# Altium project PCB_Tel_GPRS_BT-V1_Rev1.PrjPcb (part 1 of 2)
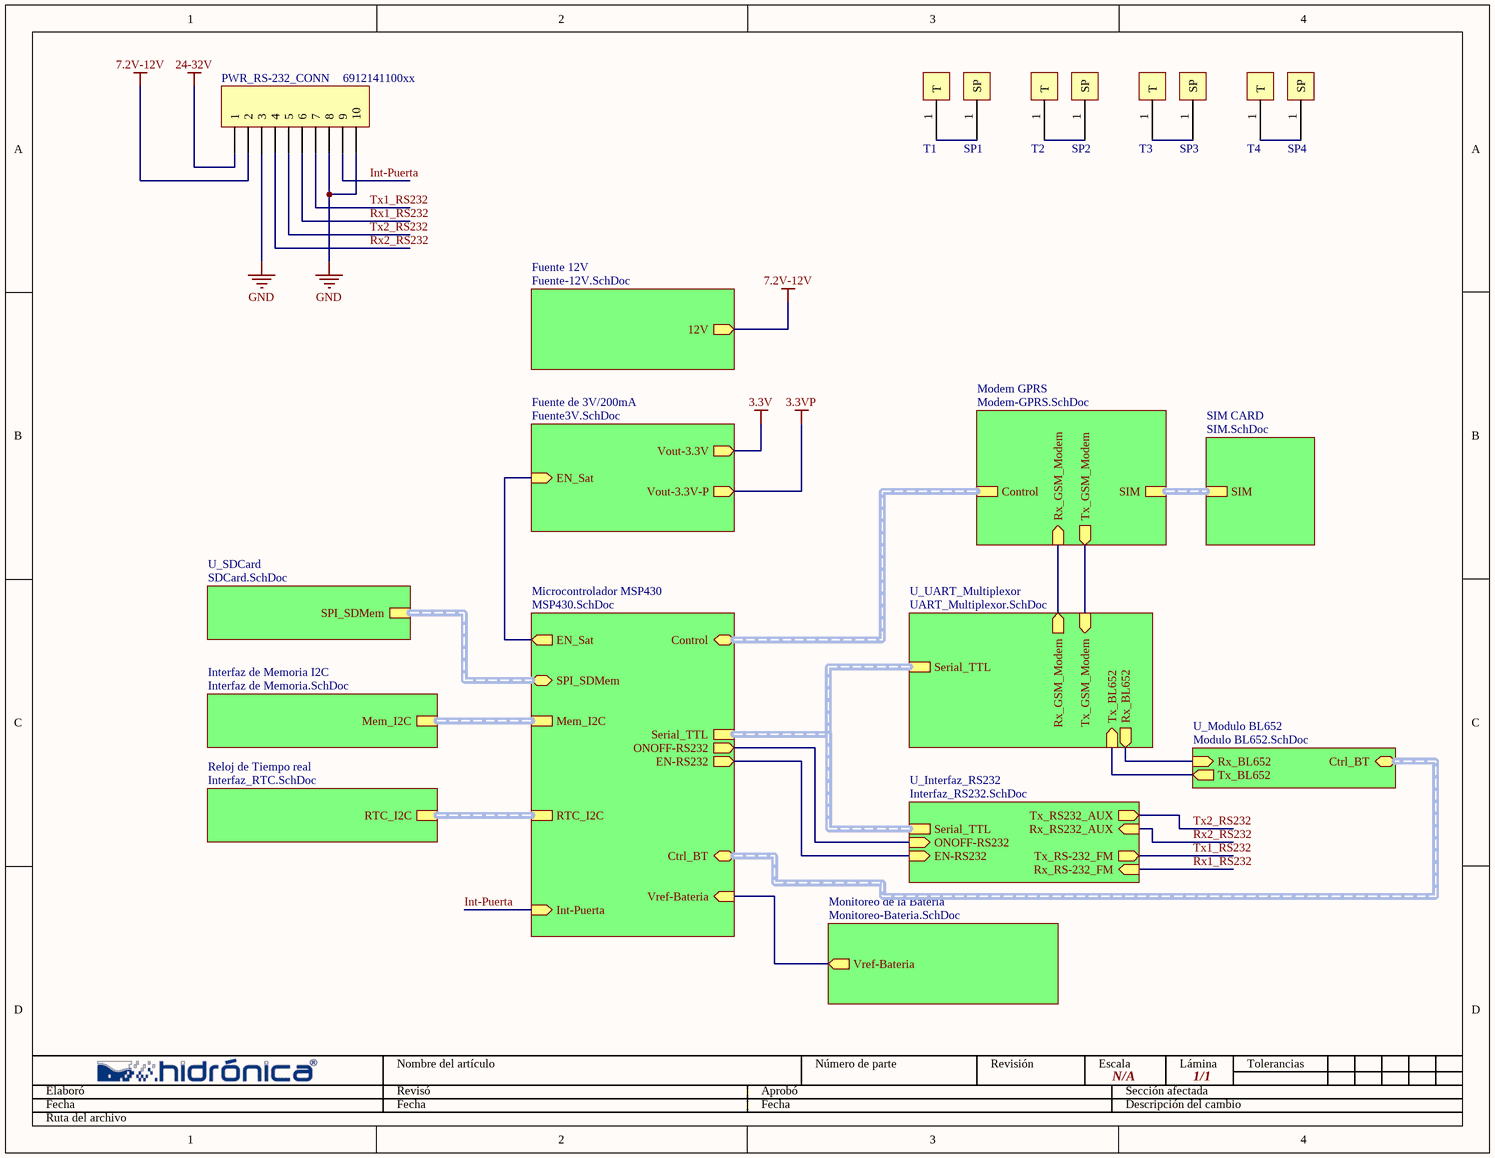
[diagram p0: Principal.SchDoc]
13 sheets, 132 parts. Net scope: hierarchical (ports join the sheet entries above them; power ports are global).
Board file: TEL-GPRS-BT-V1_0 Rev1.PcbDoc
Sheets:
  Principal.SchDoc
    Fuente de 3V/200mA = Fuente3V.SchDoc
    Interfaz de Memoria I2C = Interfaz de Memoria.SchDoc
    Reloj de Tiempo real = Interfaz_RTC.SchDoc
    Monitoreo de la Bateria = Monitoreo-Bateria.SchDoc
    Microcontrolador MSP430 = MSP430.SchDoc
    Fuente 12V = Fuente-12V.SchDoc
    Modem GPRS = Modem-GPRS.SchDoc
    SIM CARD = SIM.SchDoc
    U_Interfaz_RS232 = Interfaz_RS232.SchDoc
    U_UART_Multiplexor = UART_Multiplexor.SchDoc
    U_SDCard = SDCard.SchDoc
    U_Modulo BL652 = Modulo BL652.SchDoc

## Sheet Principal.SchDoc
size Letter; ApprovedBy: M. en C. Fernando Bolaños; CheckedBy: M. en C. José Alberto Balderas Castillo (CID); Author: M. en C. José Alberto Balderas Castillo (CID); Revision: v1; NombreTarjeta: TELCOMGPRS-v1; NumeroDeHoja: 1 de 7; NombreBloque: Diagrama a Bloques; FechaDiseno: 02-Junio-2015; FechaRevision: 05-Junio-2015; FechaAprobacion: 16-Junio-2015; TamanoHoja: Carta; NombreProyecto: Telemetria GPRS de Bajo Consumo de Energia

### Parts
PWR_RS-232_CONN  6912141100xx  [691214110002x2_691214110003x2]
SP1  (no value)  [SPACER]
SP2  (no value)  [SPACER]
SP3  (no value)  [SPACER]
SP4  (no value)  [SPACER]
T1  (no value)  [Tornillo]
T2  (no value)  [Tornillo]
T3  (no value)  [Tornillo]
T4  (no value)  [Tornillo]

### Sub-sheets
Fuente 12V = Fuente-12V.SchDoc: 12V (out)
Fuente de 3V/200mA = Fuente3V.SchDoc: Vout-3.3V (out), Vout-3.3V-P (out), EN_Sat (in)
Interfaz de Memoria I2C = Interfaz de Memoria.SchDoc: Mem_I2C (harness Memorias I2C)
Microcontrolador MSP430 = MSP430.SchDoc: Mem_I2C (harness Memorias I2C), RTC_I2C (harness Reloj RTC), Serial_TTL (harness Puertos Seriales), Vref-Bateria (in), Int-Puerta (in), ONOFF-RS232 (out), EN-RS232 (out), EN_Sat (out), Control (harness Control), SPI_SDMem (harness SPI1), Ctrl_BT (harness Bluetooth_Ctrl)
Modem GPRS = Modem-GPRS.SchDoc: SIM (harness SIM), Control (harness Control), Rx_GSM_Modem (in), Tx_GSM_Modem (out)
Monitoreo de la Bateria = Monitoreo-Bateria.SchDoc: Vref-Bateria (out)
Reloj de Tiempo real = Interfaz_RTC.SchDoc: RTC_I2C (harness Reloj RTC)
SIM CARD = SIM.SchDoc: SIM (harness SIM)
U_Interfaz_RS232 = Interfaz_RS232.SchDoc: Serial_TTL (harness Puertos Seriales), Rx_RS-232_FM (in), Tx_RS-232_FM (out), ONOFF-RS232 (in), EN-RS232 (in), Tx_RS232_AUX (out), Rx_RS232_AUX (in)
U_Modulo BL652 = Modulo BL652.SchDoc: Rx_BL652 (in), Tx_BL652 (out), Ctrl_BT (harness Bluetooth_Ctrl)
U_SDCard = SDCard.SchDoc: SPI_SDMem (harness SPI1)
U_UART_Multiplexor = UART_Multiplexor.SchDoc: Rx_GSM_Modem (out), Rx_BL652 (out), Tx_GSM_Modem (in), Tx_BL652 (in), Serial_TTL (harness Puertos Seriales)

### Nets
7.2V-12V: PWR_RS-232_CONN.2 ; sheet Fuente 12V/12V
24-32V: PWR_RS-232_CONN.1
GND: PWR_RS-232_CONN.3 PWR_RS-232_CONN.8 PWR_RS-232_CONN.10
BT_Rx: sheet U_UART_Multiplexor/Rx_BL652, sheet U_Modulo BL652/Rx_BL652
BT_Tx: sheet U_UART_Multiplexor/Tx_BL652, sheet U_Modulo BL652/Tx_BL652
Int-Puerta: PWR_RS-232_CONN.9 ; sheet Microcontrolador MSP430/Int-Puerta
Rx1_RS232: PWR_RS-232_CONN.6 ; sheet U_Interfaz_RS232/Rx_RS-232_FM
Rx2_RS232: PWR_RS-232_CONN.4 ; sheet U_Interfaz_RS232/Rx_RS232_AUX
Tx1_RS232: PWR_RS-232_CONN.7 ; sheet U_Interfaz_RS232/Tx_RS-232_FM
Tx2_RS232: PWR_RS-232_CONN.5 ; sheet U_Interfaz_RS232/Tx_RS232_AUX
NetSP1_1: SP1.1(SP) T1.1(T)
NetSP2_1: SP2.1(SP) T2.1(T)
NetSP3_1: SP3.1(SP) T3.1(T)
NetSP4_1: SP4.1(SP) T4.1(T)
NetU2_1: sheet Fuente de 3V/200mA/EN_Sat, sheet Microcontrolador MSP430/EN_Sat
NetU5D1_2: sheet Monitoreo de la Bateria/Vref-Bateria, sheet Microcontrolador MSP430/Vref-Bateria
NetU6_3: sheet Microcontrolador MSP430/EN-RS232, sheet U_Interfaz_RS232/EN-RS232
NetU6_4: sheet Microcontrolador MSP430/ONOFF-RS232, sheet U_Interfaz_RS232/ONOFF-RS232
NetU11_2: sheet Modem GPRS/Rx_GSM_Modem, sheet U_UART_Multiplexor/Rx_GSM_Modem
NetU11_4: sheet Modem GPRS/Tx_GSM_Modem, sheet U_UART_Multiplexor/Tx_GSM_Modem

### Buses and harness runs
harness sheet Interfaz de Memoria I2C/Mem_I2C = sheet Microcontrolador MSP430/Mem_I2C
harness sheet Microcontrolador MSP430/Control = sheet Modem GPRS/Control
harness sheet Microcontrolador MSP430/Ctrl_BT = sheet U_Modulo BL652/Ctrl_BT
harness sheet Microcontrolador MSP430/RTC_I2C = sheet Reloj de Tiempo real/RTC_I2C
harness sheet Microcontrolador MSP430/Serial_TTL = sheet U_Interfaz_RS232/Serial_TTL = sheet U_UART_Multiplexor/Serial_TTL
harness sheet Microcontrolador MSP430/SPI_SDMem = sheet U_SDCard/SPI_SDMem
harness sheet Modem GPRS/SIM = sheet SIM CARD/SIM

### Notes on the sheet
- Elaboró
- Fecha
- Nombre del artículo
- Revisó
- Aprobó
- Número de parte
- Revisión
- Escala
- N/A
- Sección afectada
- Descripción del cambio
- Lámina
- 1/1
- Tolerancias
- Ruta del archivo

### Library data of the parts
PWR_RS-232_CONN = Header 10H: 10 Position Wire to Board Terminal Block Horizontal with Board 0.200" (5.08mm) Through Hole; Manufacturer: Wurth Elektronik; Number of Levels: 1; Positions Per Level: 10; Pitch: 3.5 mm; Current: 15A; Voltage: 300V; Wire Gauge: 14-30 AWG; Wire Termination: Screw - Rising Cage Clamp; Torque - Screw: 0.5-0.6 Nm (4.4-5.3 Lb-In); Screw Thread: M3; LatestRevisionDate: 17-Jul-2002; LatestRevisionNote: Re-released for DXP Platform.; Publisher: Altium Limited; Numero de Parte: 6912141100xx; Supplier 1: Wurth Elektronik; Supplier Part Number 1: 6912141100xx; Manufacturer Part Number: 6912141100xx; RoHS: RoHS Compliant; Category: Connectors, Interconnects; Stock 1: 453; Pricing 1: 1=5.34, 10=5.189, 50=4.85, 100=4.462, 250=4.12248, 500=3.9285, 1000=3.686 (USD); Packaging: Bulk; Part Status: Active; Mating Orientation: Horizontal with Board; Mounting Type: Through Hole; Features: Interlocking (Side); Color: Green; Operating Temperature: -; Housing Material: Polyamide (PA), Nylon; Contact Material - Plating: -; Clamp Material - Plating: -; Screw Material - Plating: -; ComponentLink1URL: http://media.digikey.com/pdf/Data%20Sheets/Phoenix%20Contact%20PDFs/1715802.pdf; ComponentLink1Description: http://media.digikey.com/pdf/Data%20Sheets/Phoenix%20Contact%20PDFs/1715802.pdf
SP1-SP4 T1-T4 = PRUEBA: No Aplica; Numero de Parte: No Aplica

## Sheet Fuente3V.SchDoc
size Letter; ApprovedBy: M. en C. Fernando Bolaños; CheckedBy: M. en C. José Alberto Balderas Castillo (CID); Author: M. en C. José Alberto Balderas Castillo (CID); Revision: v1; NombreTarjeta: TELCOMGPRS-v1; NumeroDeHoja: 2 de 7; NombreBloque: Fuente de alimentacion de 3.3V de bajo consumo; FechaDiseno: 02-Junio-2015; FechaRevision: 05-Junio-2015; FechaAprobacion: 16-Junio-2015; TamanoHoja: Carta; NombreProyecto: Telemetria GPRS de Bajo Consumo de Energia
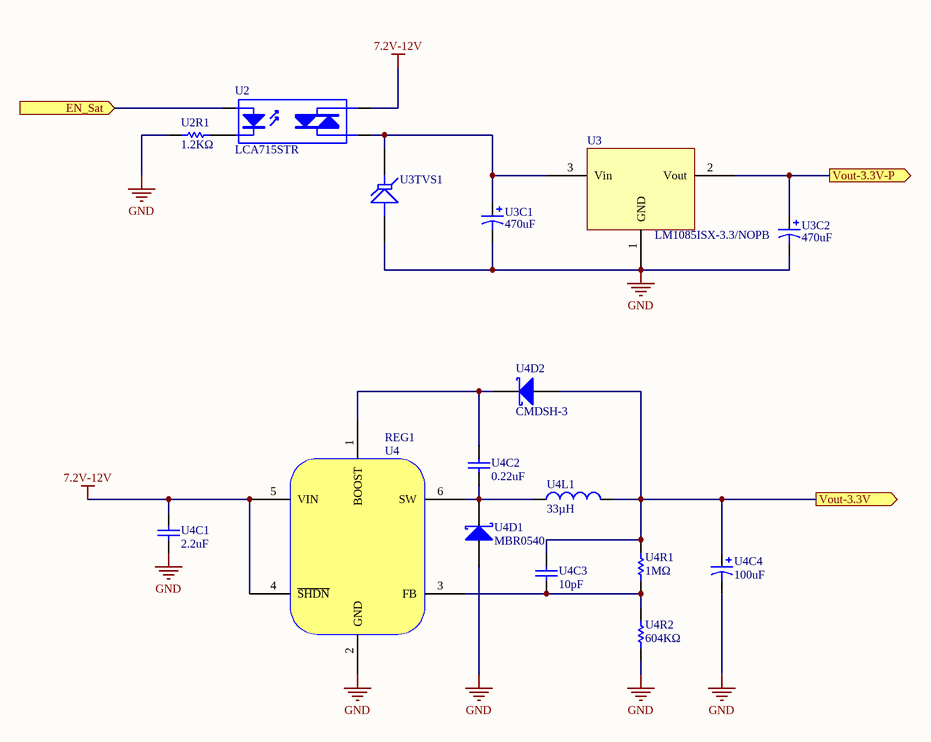
[diagram p1: Fuente3V.SchDoc]

### Parts
U2  LCA715STR  [SOP-6]
U2R1  1.2KΩ  [0805-RES]
U3  LM1085ISX-3.3/NOPB  [D2PAK3-TO263]
U3C1  470uF  [CAP-12.5X20X5]
U3C2  470uF  [CAP-12.5X20X5]
U3TVS1  20V  [DO-219AB]  (value not drawn)
U4  REG1  [SOT23-6]
U4C1  2.2uF  [1206-cap]
U4C2  0.22uF  [1206-CAP]
U4C3  10pF  [1206-CAP]
U4C4  100uF  [7343-31]
U4D1  MBR0540  [SOD-123]
U4D2  CMDSH-3  [SOD-323]
U4L1  33µH  [784774033]
U4R1  1MΩ  [0805-RES]
U4R2  604KΩ  [0805-RES]

### Ports
EN_Sat (in), Vout-3.3V (out), Vout-3.3V-P (out)

### Nets
3.3V: U4C3.2 U4C4.1 U4D2.1(A) U4L1.2 U4R1.2 ; port Vout-3.3V
3.3VP: U3.2(Vout) U3C2.1 ; port Vout-3.3V-P
7.2V-12V: U2.6(A/K) U4.4(~{SHDN}) U4.5(VIN) U4C1.2
GND: U2R1.1 U3.1(GND) U3C1.2 U3C2.2 U3TVS1.1(A) U4.2(GND) U4C1.1 U4C4.2 U4D1.1(A) U4R2.1
NetU2_1: U2.1(A) ; port EN_Sat
NetU2_2: U2.2(K) U2R1.2
NetU2_4: U2.4(A/K) U3.3(Vin) U3C1.1 U3TVS1.2(K)
NetU4_1: U4.1(BOOST) U4C2.2 U4D2.2(K)
NetU4_3: U4.3(FB) U4C3.1 U4R1.1 U4R2.2
NetU4_6: U4.6(SW) U4C2.1 U4D1.2(K) U4L1.1

### Notes on the sheet
- Elaboró
- Fecha
- Nombre del artículo
- Revisó
- Aprobó
- Número de parte
- Revisión
- Escala
- N/A
- Sección afectada
- Descripción del cambio
- Lámina
- 1/1
- Tolerancias
- Ruta del archivo

### Library data of the parts
U2 = Opto TRIAC: RELAY OPTOMOS 1.8A SPST-NO 6-SMD; Manufacturer: IXYS Integrated Circuits Division; Supplier 1: Digi-Key; Supplier Part Number 1: CLA309CT-ND; Manufacturer Part Number: LCA715STR; Supplier 2: Mouser; Supplier Part Number 2: 849-LCA715STR
U2R1 = Res1: RES SMD 1.2K OHM 1% 1/8W 0805; Manufacturer: Panasonic Electronic Components; Manufacturer Part Number: ERJ-6ENF1201V; Value: 1.2KΩ; Supplier 1: Digi-Key; Supplier Part Number 1: P1.20KCCT-ND
U3 = LD1117A: Linear Voltage Regulator IC Positive Fixed 1 Output 3.3V 3A DDPAK/TO-263-3; Manufacturer: Texas Instruments; Supplier 1: Digi-Key; Supplier Part Number 1: LM1085ISX-3.3/NOPBCT-ND; Manufacturer Part Number: LM1085ISX-3.3/NOPB
U3C1 U3C2 = Cap Pol1: 470µF 50V Aluminum Capacitors Radial, Can 27 mOhm @ 100kHz 5000 Hrs @ 105°C; Manufacturer: Kemet; Manufacturer Part Number: ESY477M050AL3AA; Value: 470uF; Supplier 1: Digi-Key; Supplier Part Number 1: 399-6129-ND
U3TVS1 = Tranzorb: TVS DIODE 18V 29.2V SMF; Manufacturer: Vishay Semiconductor Diodes Division; Manufacturer Part Number: SMF18A-E3-08; Supplier 1: Digi-Key; Supplier Part Number 1: SMF18A-E3-08CT-ND
U4 = LT1934: LINEAR TECHNOLOGY  LT1934  IC REG BUCK ADJ 0.3A SOT23-6; Manufacturer: Linear Technology/Analog Devices; Manufacturer Part Number: LT1934; Supplier 1: Digi-Key; Supplier Part Number 1: LT1934ES6#TRMPBFCT-ND
U4C1 = Cap: CAP CER 2.2UF 50V 10% X5R 1206; Manufacturer: Taiyo Yuden; Manufacturer Part Number: UMK316BJ225KD-T; Value: 2.2uF; Supplier 1: Digi-Key; Supplier Part Number 1: 587-2402-1-ND
U4C2 = Cap: CAP CER 0.22UF 50V 10% X7R 1206; Manufacturer: Samsung Electro-mechanics; Manufacturer Part Number: CL31B224KBFNNNE; Value: 0.22uF; Supplier 1: Digi-Key; Supplier Part Number 1: 1276-1106-1-ND
U4C3 = Cap: CAP CER 10PF 50V 10% NP0 1206; Manufacturer: Kemet; Manufacturer Part Number: C1206C100K5GACTU; Value: 10pF; Supplier 1: Digi-Key; Supplier Part Number 1: 399-9297-1-ND
U4C4 = Cap Pol1: CAP TANT 100UF 16V 10% 2917; Manufacturer: Kemet; Manufacturer Part Number: T495D107K016AHE125; Value: 100uF; Supplier 1: Digi-Key; Supplier Part Number 1: 399-8498-1-ND
U4D1 = D Schottky: DIODE SCHOTTKY 40V 500MA SOD123; Manufacturer: Micro Commercial Co; Manufacturer Part Number: MBR0540-TP; Supplier 1: Digi-Key; Supplier Part Number 1: MBR0540TPMSCT-ND
U4D2 = D Schottky: DIODE SCHOTTKY 30V 100MA SOD323; Manufacturer: Central Semiconductor Corp; Manufacturer Part Number: CMDSH-3 TR; Supplier 1: Digi-Key; Supplier Part Number 1: CMDSH-3 CT-ND
U4L1 = Inductor: WE-PD2A SMD Power Inductor; Manufacturer: Wurth Elektronik; Manufacturer Part Number: 784774133; Value: 33µH; Supplier Part Number 1: 784774133; Supplier 1: Wurth Elektronik
U4R1 = Res1: RES SMD 1M OHM 0.1% 1/8W 0805; Manufacturer: Panasonic Electronic Components; Manufacturer Part Number: ERA-6AEB105V; Value: 1MΩ; Supplier 1: Digi-Key; Supplier Part Number 1: P1MDACT-ND
U4R2 = Res1: RES SMD 604K OHM 0.1% 1/8W 0805; Manufacturer: Yageo; Manufacturer Part Number: RT0805BRD07604KL; Value: 604KΩ; Supplier 1: Digi-Key; Supplier Part Number 1: YAG1941CT-ND

## Sheet Interfaz de Memoria.SchDoc
size Letter; ApprovedBy: M. en C. Fernando Bolaños; CheckedBy: M. en C. José Alberto Balderas Castillo (CID); Author: M. en C. José Alberto Balderas Castillo (CID); Revision: v1; NombreTarjeta: TELCOMGPRS-v1; NumeroDeHoja: 3 de 7; NombreBloque: Memorias externas EEPROM; FechaDiseno: 02-Junio-2015; FechaRevision: 05-Junio-2015; FechaAprobacion: 16-Junio-2015; TamanoHoja: Carta; NombreProyecto: Telemetria GPRS de Bajo Consumo de Energia
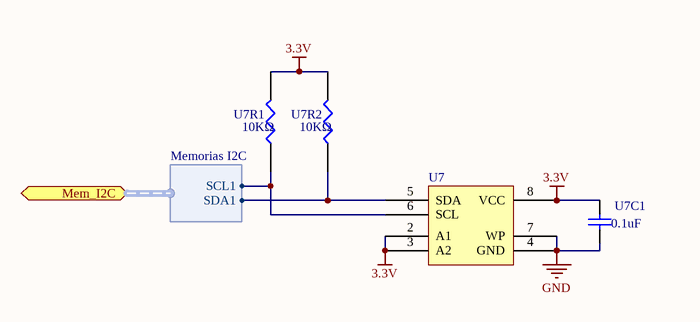
[diagram p2: Interfaz de Memoria.SchDoc]

### Parts
U7  CAT24M01WI-GT3  [SO-G8/Y1.9]  (value not drawn)
U7C1  0.1uF  [0603 - CAP]
U7R1  10KΩ  [0805-RES]
U7R2  10KΩ  [0805-RES]

### Ports
Mem_I2C (harness Memorias I2C)

### Harnesses
Memorias I2C: SDA1, SCL1

### Nets
3.3V: U7.2(A1) U7.3(A2) U7.8(VCC) U7C1.2 U7R1.2 U7R2.2
GND: U7.4(GND) U7.7(WP) U7C1.1
NetU6_40: U7.5(SDA) U7R2.1 ; port Mem_I2C.SDA1
NetU6_41: U7.6(SCL) U7R1.1 ; port Mem_I2C.SCL1

Not connected (* = marked no-connect by the designer): U7 1(NC)

### Notes on the sheet
- Elaboró
- Fecha
- Nombre del artículo
- Revisó
- Aprobó
- Número de parte
- Revisión
- Escala
- N/A
- Sección afectada
- Descripción del cambio
- Lámina
- 1/1
- Tolerancias
- Ruta del archivo

### Library data of the parts
U7 = AT24C1024BN-SH-B: IC EEPROM 1MBIT 1MHZ 8SOIC I2C; Manufacturer: ON Semiconductor; Supplier 1: Digi-Key; Supplier Part Number 1: CAT24M01WI-GT3OSCT-ND; Manufacturer Part Number: CAT24M01WI-GT3
U7C1 = Cap: CAP CERAMIC 0.1UF, 25V, X7R, 0603; Manufacturer Part Number: CGJ3E2X7R1E104K080AA; Manufacturer: TDK Corporation; Value: 0.1uF; Supplier 1: Digi-Key; Supplier Part Number 1: 445-8129-1-ND
U7R1 U7R2 = RES1: 10 kOhms ±5% 0.125W, 1/8W Chip Resistor 0805; Manufacturer Part Number: RC0805JR-0710KL; Manufacturer: Yageo; Value: 10KΩ; Supplier 1: Digi-Key; Supplier Part Number 1: 311-10KARCT-ND

## Sheet Interfaz_RTC.SchDoc
size Letter; ApprovedBy: M. en C. Fernando Bolaños; CheckedBy: M. en C. José Alberto Balderas Castillo (CID); Author: M. en C. José Alberto Balderas Castillo (CID); Revision: v1; NombreTarjeta: TELCOMGPRS-v1; NumeroDeHoja: 4 de 7; NombreBloque: Reloj de Tiempo Real; FechaDiseno: 02-Junio-2015; FechaRevision: 05-Junio-2015; FechaAprobacion: 16-Junio-2015; TamanoHoja: Carta; NombreProyecto: Telemetria GPRS de Bajo Consumo de Energia
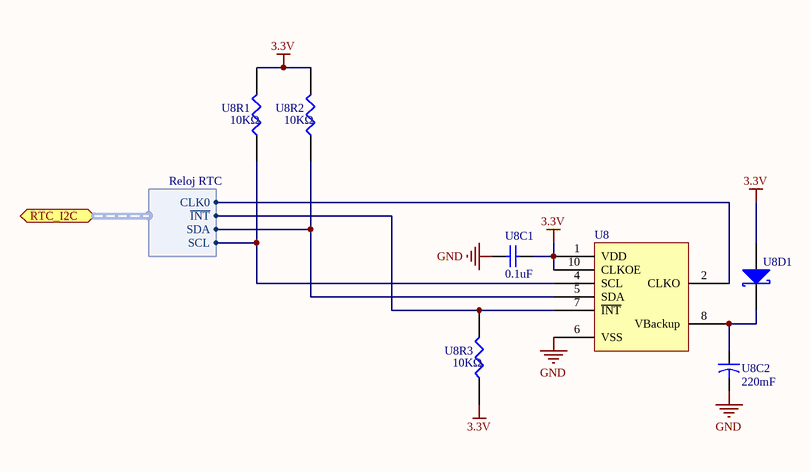
[diagram p3: Interfaz_RTC.SchDoc]

### Parts
U8  (no value)  [RV-3029-C2]
U8C1  0.1uF  [0603 - CAP]
U8C2  220mF  [DSK-3R3H224U-HL]
U8D1  NSR0320MW2T1G  [SOD-323]  (value not drawn)
U8R1  10KΩ  [0805-RES]
U8R2  10KΩ  [0805-RES]
U8R3  10KΩ  [0805-RES]

### Ports
RTC_I2C (harness Reloj RTC)

### Harnesses
Reloj RTC: CLK0, ~{INT}, SDA, SCL

### Nets
3.3V: U8.1(VDD) U8.10(CLKOE) U8C1.1 U8D1.1(A) U8R1.2 U8R2.2 U8R3.1
GND: U8.6(VSS) U8C1.2 U8C2.2
NetU6_36: U8.2(CLKO) ; port RTC_I2C.CLK0
NetU6_37: U8.7(~{INT}) U8R3.2 ; port RTC_I2C.~{INT}
NetU6_38: U8.5(SDA) U8R2.1 ; port RTC_I2C.SDA
NetU6_39: U8.4(SCL) U8R1.1 ; port RTC_I2C.SCL
NetU8_8: U8.8(VBackup) U8C2.1 U8D1.2(K)

Not connected (* = marked no-connect by the designer): U8 3(NC) 9(NC)

### Notes on the sheet
- Elaboró
- Fecha
- Nombre del artículo
- Revisó
- Aprobó
- Número de parte
- Revisión
- Escala
- N/A
- Sección afectada
- Descripción del cambio
- Lámina
- 1/1
- Tolerancias
- Ruta del archivo

### Library data of the parts
U8 = RV-3029-C2 B: MICRO CRYSTAL - RV-3029-C2 OPTION B - REAL-TIME-CLOCK, SMD, I2C, 32.768KHZ; Manufacturer: Micro Crystal Switzerland; Manufacturer Part Number: RV-3029-C2; Supplier 1: Newark; Supplier Part Number 1: 19P2786; Supplier 2: Mouser; Supplier Part Number 2: 428-202115-MG01
U8C1 = Cap: as U7C1 on sheet Interfaz de Memoria; Value: 0.1uF; Supplier 1: Digi-Key; Supplier Part Number 1: 445-8129-1-ND
U8C2 = Cap2: CAP 220MF -20% +80% 3.3V SMD; Manufacturer: Elna America; Value: 220mF; Supplier 1: Digi-Key; Supplier Part Number 1: 604-1020-1-ND; Manufacturer Part Number: DSK-3R3H224U-HL; Voltage - Rated: 3.3V
U8D1 = 10MQ060N: DIODE SCHOTTKY 1A 20V SOD-323; Manufacturer: On Semiconductor; Manufacturer Part Number: NSR0320MW2T1G; Supplier 1: Digi-Key; Supplier Part Number 1: NSR0320MW2T1GOSCT-ND
U8R1-U8R3 = RES1: as U7R1 on sheet Interfaz de Memoria; Value: 10KΩ; Supplier 1: Digi-Key; Supplier Part Number 1: 311-10KARCT-ND

## Sheet Monitoreo-Bateria.SchDoc
size Letter; ApprovedBy: M. en C. Fernando Bolaños; CheckedBy: M. en C. José Alberto Balderas Castillo (CID); Author: M. en C. José Alberto Balderas Castillo (CID); Revision: v1; NombreTarjeta: TELCOMGPRS-v1; NumeroDeHoja: 6 de 7; NombreBloque: Monitoreo del Voltaje de Alimentación de la Bateria; FechaDiseno: 02-Junio-2015; FechaRevision: 05-Junio-2015; FechaAprobacion: 16-Junio-2015; TamanoHoja: Carta; NombreProyecto: Telemetria GPRS de Bajo Consumo de Energia
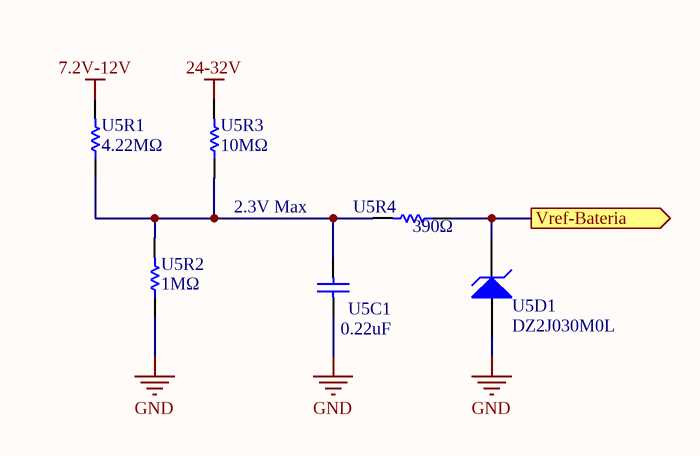
[diagram p4: Monitoreo-Bateria.SchDoc]

### Parts
U5C1  0.22uF  [0603 - CAP]
U5D1  DZ2J030M0L  [SOD-323]
U5R1  4.22MΩ  [0805-RES]
U5R2  1MΩ  [0805-RES]
U5R3  10MΩ  [0805-RES]
U5R4  390Ω  [0603-RES]

### Ports
Vref-Bateria (out)

### Nets
7.2V-12V: U5R1.2
24-32V: U5R3.2
GND: U5C1.2 U5D1.1(A) U5R2.1
NetU5C1_1: U5C1.1 U5R1.1 U5R2.2 U5R3.1 U5R4.2
NetU5D1_2: U5D1.2(K) U5R4.1 ; port Vref-Bateria

### Notes on the sheet
- 2.3V Max
- Elaboró
- Fecha
- Nombre del artículo
- Revisó
- Aprobó
- Número de parte
- Revisión
- Escala
- N/A
- Sección afectada
- Descripción del cambio
- Lámina
- 1/1
- Tolerancias
- Ruta del archivo

### Library data of the parts
U5C1 = Cap: CAP CER 0.22UF 16V 10% X7R 0603; Manufacturer: Kemet; Manufacturer Part Number: C0603C224K4RAC7867; Value: 0.22uF; Supplier 1: Digi-Key; Supplier Part Number 1: 399-5619-1-ND
U5D1 = D Zener: PANASONIC ELECTRONIC COMPONENTS  DZ2J030M0L  DIODE, ZENER, 3.0V, SMINI2-F5-B; Supplier 1: Digi-Key; Supplier Part Number 1: DZ2J030M0LCT-ND; Manufacturer: Panasonic Electronic Components; Manufacturer Part Number: DZ2J030M0L
U5R1 = Res1: VISHAY  CRCW08054M22FKEA  Resistencia SMD Chip, Película Gruesa, 4.22 Mohm, 150 V, 0805 [2012 Metric], 125 mW, ± 1%; Manufacturer: Vishay Dale; Value: 4.22MΩ; Supplier 1: Digi-Key; Supplier Part Number 1: 541-4.22MCCT-ND; Manufacturer Part Number: CRCW08054M22FKEA; Supplier 2: Mouser; Supplier Part Number 2: 71-CRCW08054M22FKEA; Supplier 3: Newark; Supplier Part Number 3: 53K0223
U5R2 = Res1: VISHAY  CRCW08051M00FKEB  Resistencia SMD Chip, Película Gruesa, 1 Mohm, 150 V, 0805 [2012 Metric], 125 mW, ± 1%; Manufacturer Part Number: CRCW08051M00FKEA; Value: 1MΩ; Supplier 1: Digi-Key; Supplier Part Number 1: 541-1.00MCCT-ND; Manufacturer: VISHAY; Supplier 2: Newark; Supplier Part Number 2: 52K9759
U5R3 = Res1: VISHAY  CRCW080510M0JNEA  Resistencia SMD Chip, Película Gruesa, 10 Mohm, 150 V, 0805 [2012 Metric], 125 mW, ± 5%; Manufacturer: Vishay Dale; Value: 10MΩ; Supplier 1: Digi-Key; Supplier Part Number 1: 541-10MACT-ND; Manufacturer Part Number: CRCW080510M0JNEA
U5R4 = Res1: YAGEO  RC0603JR-07390RL  Resistencia SMD Chip, Película Gruesa, Serie RC, 390 ohm, 50 V, 0603 [1608 Metric], 100 mW, ± 5%; Value: 390Ω; Supplier 1: Digi-Key; Supplier Part Number 1: 311-390GRCT-ND; Manufacturer: Yageo; Manufacturer Part Number: RC0603JR-07390RL

## Sheet MSP430.SchDoc
size Letter; ApprovedBy: M. en C. Fernando Bolaños; CheckedBy: M. en C. José Alberto Balderas Castillo (CID); Author: M. en C. José Alberto Balderas Castillo (CID); Revision: v1; NombreTarjeta: TELCOMGPRS-v1; NumeroDeHoja: 7 de 7; NombreBloque: Microcontrolador MSP430; FechaDiseno: 02-Junio-2015; FechaRevision: 05-Junio-2015; FechaAprobacion: 16-Junio-2015; TamanoHoja: Carta; NombreProyecto: Telemetria GPRS de Bajo Consumo de Energia
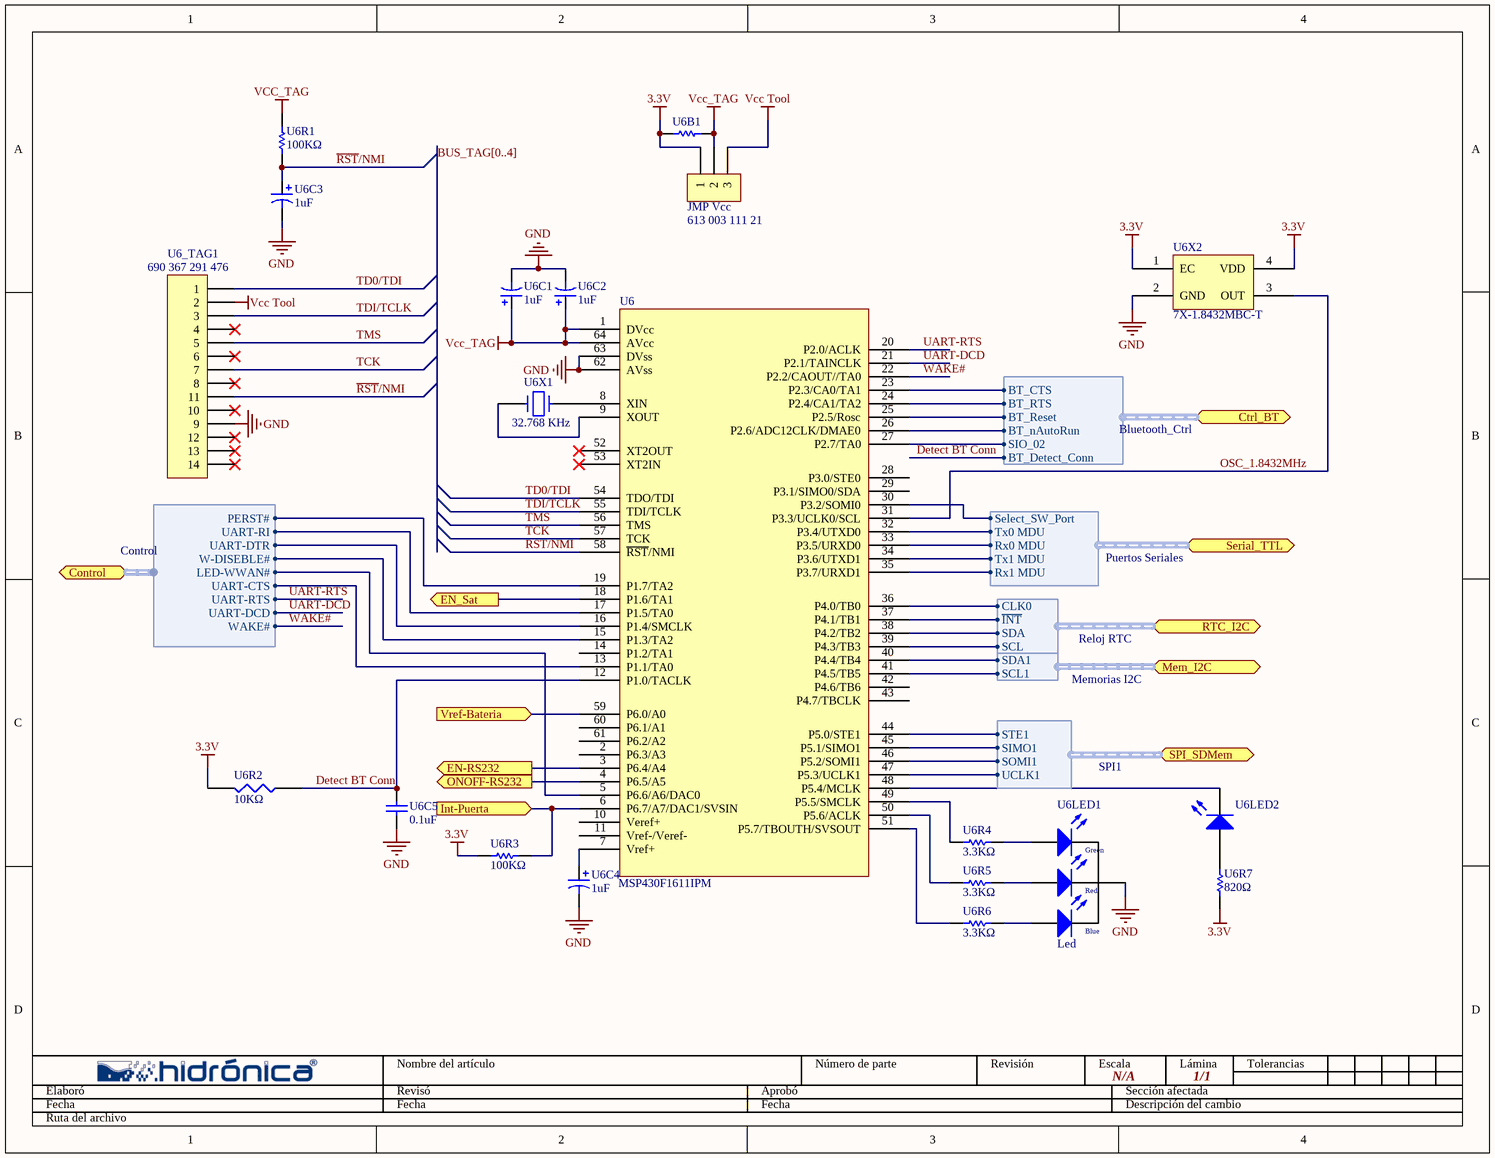
[diagram p5: MSP430.SchDoc]

### Parts
JMP_Vcc  613 003 111 21  [HDR1X3]
U6  MSP430F1611IPM  [LQFP-64]
U6_TAG1  690 367 291 476  [690367291476]
U6B1  (no value)  [Bypass Bridge]
U6C1  1uF  [0805-tan]
U6C2  1uF  [0805-tan]
U6C3  1uF  [0805-tan]
U6C4  1uF  [0805-tan]
U6C5  0.1uF  [0603 - CAP]
U6LED1  Led  [HDR1X4]
U6LED2  LED2  [0805-LEDG]  (value not drawn)
U6R1  100KΩ  [0805-RES]
U6R2  10KΩ  [0805-RES]
U6R3  100KΩ  [0805-RES]
U6R4  3.3KΩ  [0805-RES]
U6R5  3.3KΩ  [0805-RES]
U6R6  3.3KΩ  [0805-RES]
U6R7  820Ω  [0805-RES]
U6X1  32.768 KHz  [XTAL SMD 3.2 x 1.5]
U6X2  7X-1.8432MBC-T  [7X-1.8432MBC-T]

### Ports
Control (harness Control), Ctrl_BT (harness Bluetooth_Ctrl), EN-RS232 (out), EN_Sat (out), Int-Puerta (in), Mem_I2C (harness Memorias I2C), ONOFF-RS232 (out), RTC_I2C (harness Reloj RTC), Serial_TTL (harness Puertos Seriales), SPI_SDMem (harness SPI1), Vref-Bateria (in)

### Harnesses
Memorias I2C: SDA1, SCL1
Reloj RTC: CLK0, ~{INT}, SDA, SCL
Puertos Seriales: Select_SW_Port, Tx0 MDU, Rx1 MDU, Rx0 MDU, Tx1 MDU
Control: UART-RI, UART-DTR, PERST#, W-DISEBLE#, LED-WWAN#, UART-CTS, UART-RTS, UART-DCD, WAKE#
SPI1: STE1, SIMO1, SOMI1, UCLK1
Bluetooth_Ctrl: BT_Reset, BT_nAutoRun, SIO_02, BT_RTS, BT_CTS, BT_Detect_Conn

### Nets
3.3V: JMP_Vcc.1 U6B1.2 U6R2.2 U6R3.2 U6R7.2 U6X2.1(EC) U6X2.4(VDD)
GND: U6.62(AVss) U6.63(DVss) U6_TAG1.9 U6C1.2 U6C2.2 U6C3.2 U6C4.2 U6C5.2 U6LED1.1(A) U6X2.2(GND)
Vcc Tool: JMP_Vcc.3 U6_TAG1.2
VCC_TAG: JMP_Vcc.2 U6.1(DVcc) U6.64(AVcc) U6B1.1 U6C1.1 U6C2.1 U6R1.2
BT_CTS: U6.23(P2.3/CA0/TA1) ; port Ctrl_BT.BT_CTS
BT_nAutoRun: U6.26(P2.6/ADC12CLK/DMAE0) ; port Ctrl_BT.BT_nAutoRun
BT_RESET: U6.25(P2.5/Rosc) ; port Ctrl_BT.BT_Reset
BT_RTS: U6.24(P2.4/CA1/TA2) ; port Ctrl_BT.BT_RTS
BT_SIO_02: U6.27(P2.7/TA0) ; port Ctrl_BT.SIO_02
Detect BT Conn: U6.12(P1.0/TACLK) U6C5.1 U6R2.1 ; port Ctrl_BT.BT_Detect_Conn  [project net BT_Detect_Conn]
Int-Puerta: U6.6(P6.7/A7/DAC1/SVSIN) U6R3.1 ; port Int-Puerta
OSC_1.8432MHz: U6.31(P3.3/UCLK0/SCL) U6X2.3(OUT)
~{RST}/NMI: U6.58(~{RST}/NMI) U6_TAG1.11 U6C3.1 U6R1.1
TCK: U6.57(TCK) U6_TAG1.7
TD0/TDI: U6.54(TDO/TDI) U6_TAG1.1
TDI/TCLK: U6.55(TDI/TCLK) U6_TAG1.3
TMS: U6.56(TMS) U6_TAG1.5
UART-DCD: U6.21(P2.1/TAINCLK) ; port Control.UART-DCD
UART-RTS: U6.20(P2.0/ACLK) ; port Control.UART-RTS
WAKE#: U6.22(P2.2/CAOUT//TA0) ; port Control.WAKE#
NetU2_1: U6.18(P1.6/TA1) ; port EN_Sat
NetU5D1_2: U6.59(P6.0/A0) ; port Vref-Bateria
NetU6_3: U6.3(P6.4/A4) ; port EN-RS232
NetU6_4: U6.4(P6.5/A5) ; port ONOFF-RS232
NetU6_5: U6.5(P6.6/A6/DAC0) ; port Control.LED-WWAN#
NetU6_7: U6.7(Vref+) U6C4.1
NetU6_8: U6.8(XIN) U6X1.2
NetU6_9: U6.9(XOUT) U6X1.1
NetU6_13: U6.13(P1.1/TA0) ; port Control.UART-CTS
NetU6_15: U6.15(P1.3/TA2) ; port Control.W-DISEBLE#
NetU6_16: U6.16(P1.4/SMCLK) ; port Control.UART-DTR
NetU6_17: U6.17(P1.5/TA0) ; port Control.UART-RI
NetU6_19: U6.19(P1.7/TA2) ; port Control.PERST#
NetU6_30: U6.30(P3.2/SOMI0) ; port Serial_TTL.Select_SW_Port
NetU6_32: U6.32(P3.4/UTXD0) ; port Serial_TTL.Tx0 MDU
NetU6_33: U6.33(P3.5/URXD0) ; port Serial_TTL.Rx0 MDU
NetU6_34: U6.34(P3.6/UTXD1) ; port Serial_TTL.Tx1 MDU
NetU6_35: U6.35(P3.7/URXD1) ; port Serial_TTL.Rx1 MDU
NetU6_36: U6.36(P4.0/TB0) ; port RTC_I2C.CLK0
NetU6_37: U6.37(P4.1/TB1) ; port RTC_I2C.~{INT}
NetU6_38: U6.38(P4.2/TB2) ; port RTC_I2C.SDA
NetU6_39: U6.39(P4.3/TB3) ; port RTC_I2C.SCL
NetU6_40: U6.40(P4.4/TB4) ; port Mem_I2C.SDA1
NetU6_41: U6.41(P4.5/TB5) ; port Mem_I2C.SCL1
NetU6_44: U6.44(P5.0/STE1) ; port SPI_SDMem.STE1
NetU6_45: U6.45(P5.1/SIMO1) ; port SPI_SDMem.SIMO1
NetU6_46: U6.46(P5.2/SOMI1) ; port SPI_SDMem.SOMI1
NetU6_47: U6.47(P5.3/UCLK1) ; port SPI_SDMem.UCLK1
NetU6_48: U6.48(P5.4/MCLK) U6LED2.2(K)
NetU6_49: U6.49(P5.5/SMCLK) U6R4.2
NetU6_50: U6.50(P5.6/ACLK) U6R5.2
NetU6_51: U6.51(P5.7/TBOUTH/SVSOUT) U6R6.2
NetU6LED1_2: U6LED1.2(C3) U6R6.1
NetU6LED1_3: U6LED1.3(C2) U6R5.1
NetU6LED1_4: U6LED1.4(C1) U6R4.1
NetU6LED2_1: U6LED2.1(A) U6R7.1

Not connected (* = marked no-connect by the designer): U6 2(P6.3/A3) 10(Veref+) 11(Vref-/Veref-) 14(P1.2/TA1) 28(P3.0/STE0) 29(P3.1/SIMO0/SDA) 42(P4.6/TB6) 43(P4.7/TBCLK) 52(XT2OUT)* 53(XT2IN)* 60(P6.1/A1) 61(P6.2/A2); U6_TAG1 4* 6* 8* 10* 12* 13* 14*

### Buses and harness runs
bus BUS_TAG[0..4]

### Notes on the sheet
- Elaboró
- Fecha
- Nombre del artículo
- Revisó
- Aprobó
- Número de parte
- Revisión
- Escala
- N/A
- Sección afectada
- Descripción del cambio
- Lámina
- 1/1
- Tolerancias
- Ruta del archivo
- (in symbol RGB-Catodo) Green; Red; Blue

### Library data of the parts
JMP_Vcc = CON3: 2.54mm THT Pin Header WR-PHD 3 terminales; Manufacturer: Wurth Elektronik; Manufacturer Part Number: 613 003 111 21; Supplier Part Number 1: 613 003 111 21; Supplier 1: Wurth Elektronik
U6 = MSP430F16xx: IC MCU 16BIT 48K FLASH 64-LQFP; Manufacturer: Texas Instruments; Manufacturer Part Number: MSP430F1611IPM; Supplier 1: Digi-Key; Supplier Part Number 1: 296-17205-ND
U6_TAG1 = CON14: Female SMT Straight Connector with Latch and with Polarization WR-MM 14-Pin; Contraparte: 690 157 001 472; Manufacturer: Wurth Elektronik; Supplier Part Number 1: 690 367 291 476; Supplier 1: Wurth Elektronik; Manufacturer Part Number: 690 367 291 476
U6B1 = Res1: No Aplica; Numero de Parte: No Aplica
U6C1-U6C4 = Cap Pol1: AVX - TACU105M016X - CAP TANT 1UF, 16V, 7.5OHM, 0805; Manufacturer: AVX Corporation; Manufacturer Part Number: TAJR105K010RNJ; Value: 1uF; Supplier 1: Digi-Key; Supplier Part Number 1: 478-3278-1-ND
U6C5 = Cap: as U7C1 on sheet Interfaz de Memoria; Value: 0.1uF; Supplier 1: Digi-Key; Supplier Part Number 1: 445-8129-1-ND
U6LED1 = RGB-Catodo: KINGBRIGHT  L-154A4SURKQBDZGW  LED, RGB, Rojo, Verde, Azul, Through Hole, T-1 3/4 (5mm), 60 °, Abovedada, R 20mA, G 20mA, B 20mA, Common Cathode; Supplier 1: Newark; Supplier Part Number 1: 66W1973; Manufacturer: KINGBRIGHT; Manufacturer Part Number: L-154A4SURKQBDZGW
U6LED2 = LED2: WL-SMCW SMD mono-color chip LED waterclear 0805 Green; Manufacturer: WURTH ELEKTRONIK; Manufacturer Part Number: 150080GS75000; Supplier 2: Digi-Key; Supplier Part Number 2: 732-4983-1-ND; Supplier 3: Newark; Supplier Part Number 3: 95W3800; Supplier 1: Wurth Elektronik; Supplier Part Number 1: 150080GS75000
U6R1 U6R3 = Res1: RES SMD 100K OHM 5% 1/2W 0805; Manufacturer: Panasonic; Manufacturer Part Number: ERJ-P06J104V; Value: 100KΩ; Supplier 1: Digi-Key; Supplier Part Number 1: P100KADCT-ND
U6R2 = RES1: as U7R1 on sheet Interfaz de Memoria; Value: 10KΩ; Supplier 1: Digi-Key; Supplier Part Number 1: 311-10KARCT-ND
U6R4-U6R6 = Res1: RES SMD 3.3K OHM 5% 1/8W 0805; Manufacturer: Panasonic Electronic Components; Manufacturer Part Number: ERJ-6GEYJ332V; Value: 3.3KΩ; Supplier 1: Digi-Key; Supplier Part Number 1: P3.3KACT-ND
U6R7 = Res1: PANASONIC ELECTRONIC COMPONENTS  ERJ-6GEYJ821V  Resistencia SMD Chip, Película Gruesa, 820 ohm, 150 V, 0805 [2012 Metric], 125 mW, ± 5%; Value: 820Ω; Supplier 2: Newark; Supplier Part Number 2: 65T8844; Manufacturer: PANASONIC ELECTRONIC COMPONENTS; Manufacturer Part Number: ERJ-6GEYJ821V; Supplier 1: Digi-Key; Supplier Part Number 1: P820ACT-ND
U6X1 = CRYSTAL: CRYSTAL 32.7680KHZ 12.5PF SMD  -40°C ~ 85°C; Manufacturer: EPSON; Manufacturer Part Number: FC-135 32.768KA-A3; Supplier 1: Digi-Key; Supplier Part Number 1: SE2413CT-ND
U6X2 = 7X-1.8432MBC-T: 7X-1.8432MBC-T -  Oscilador, 1.8432 MHz, 100 ppm, SMD, 5mm x 3.2mm, CMOS, 3.3 V, Serie 7X; Manufacturer: TXC; Manufacturer Part Number: 7X-1.8432MBC-T; Supplier 1: Newark; Supplier Part Number 1: 29X6515

## Sheet Fuente-12V.SchDoc
size Letter; ApprovedBy: M. en C. Fernando Bolaños; CheckedBy: M. en C. José Alberto Balderas Castillo (CID); Author: M. en C. José Alberto Balderas Castillo (CID); Revision: v2; NombreTarjeta: TELCOMSATGPRS-v2; NumeroDeHoja: 2 de 7; NombreBloque: Fuentes de alimentacion conmutadas de DC-DC; FechaDiseno: AGOSTO 2015; FechaRevision: AGOSTO 2015; FechaAprobacion: AGOSTO 2015; TamanoHoja: Carta; NombreProyecto: Telemetria GPRS y Satelital
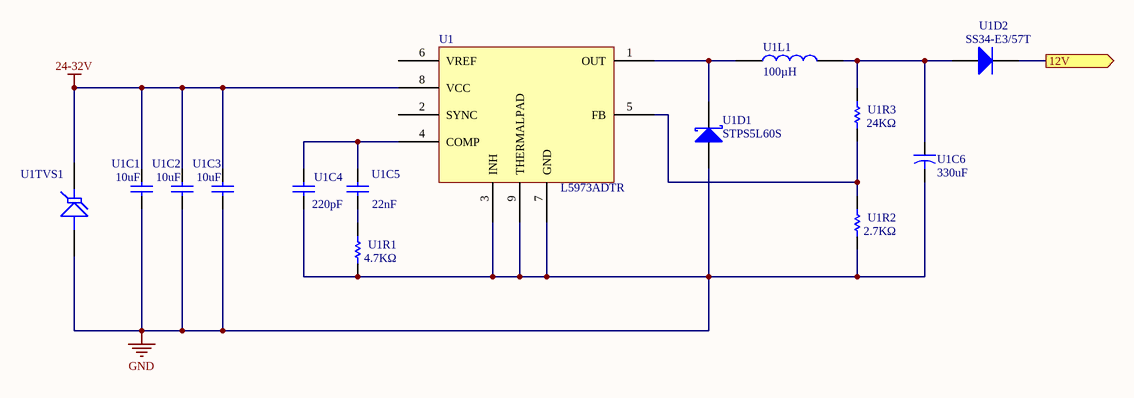
[diagram p6: Fuente-12V.SchDoc]

### Parts
U1  L5973ADTR  [SOIC-8-T]
U1C1  10uF  [1210-CAP]
U1C2  10uF  [1210-CAP]
U1C3  10uF  [1210-CAP]
U1C4  220pF  [1206-CAP]
U1C5  22nF  [1206-CAP]
U1C6  value 330uF  [CAPPR3.5-8x11.5]  (hidden comment: ECA-1EM331)
U1D1  STPS5L60S  [DO-214AB]
U1D2  SS34-E3/57T  [DO-214AB]
U1L1  100µH  [1280-IND]
U1R1  4.7KΩ  [1206-RES]
U1R2  2.7KΩ  [0805-RES]
U1R3  24KΩ  [0805-RES]
U1TVS1  33V  [DO-15]  (value not drawn)

### Ports
12V (out)

### Nets
7.2V-12V: U1D2.2(K) ; port 12V
24-32V: U1.8(VCC) U1C1.2 U1C2.2 U1C3.2 U1TVS1.2(K)
GND: U1.3(INH) U1.7(GND) U1.9(THERMALPAD) U1C1.1 U1C2.1 U1C3.1 U1C4.1 U1C6.2 U1D1.1(A) U1R1.1 U1R2.2 U1TVS1.1(A)
NetU1_1: U1.1(OUT) U1D1.2(K) U1L1.1
NetU1_4: U1.4(COMP) U1C4.2 U1C5.2
NetU1_5: U1.5(FB) U1R2.1 U1R3.2
NetU1C5_1: U1C5.1 U1R1.2
NetU1C6_1: U1C6.1 U1D2.1(A) U1L1.2 U1R3.1

Not connected (* = marked no-connect by the designer): U1 2(SYNC) 6(VREF)

### Notes on the sheet
- Elaboró
- Fecha
- Nombre del artículo
- Revisó
- Aprobó
- Número de parte
- Revisión
- Escala
- N/A
- Sección afectada
- Descripción del cambio
- Lámina
- 1/1
- Tolerancias
- Ruta del archivo

### Library data of the parts
U1 = L5973AD: IC REG SW 2A STEPDOWN 8-SOIC; Manufacturer: STMicroelectronics; Supplier 1: Digi-Key; Supplier Part Number 1: 497-5328-1-ND; Manufacturer Part Number: L5973ADTR
U1C1-U1C3 = Cap: CAP CER 10UF 50V Y5V 1210; Manufacturer Part Number: CC1210ZKY5V9BB106; Manufacturer: Yageo; Temporary Manufacturer Part Number: CL32B106KLULNNE; Temporary Manufacturer: Samsung Electro-Mechanics; Temporay Part Description: CAP CER 10UF 35V X7R 1210; Value: 10uF; Supplier 2: Mouser; Supplier Part Number 2: 603-CC121ZKY5V9BB106; Supplier 1: Digi-Key; Supplier Part Number 1: 311-3470-1-ND; Temporary Supplier 1: Digi-Key; Temporary Supplier Part Number 1: 1276-3323-1-ND
U1C4 = Cap: CAP CERAMIC 220PF 50V NP0 1206; Manufacturer: Kemet; Manufacturer Part Number: C1206C221K5GACTU; Revision: July-2002: Re-released for DXP Platform.; Value: 220pF; Supplier 1: Digi-Key; Supplier Part Number 1: 399-1208-1-ND
U1C5 = Cap: CAP 22000PF 50V CERAMIC X7R 1206; Manufacturer: Kemet; Manufacturer Part Number: C1206C223K5RACTU; Revision: July-2002: Re-released for DXP Platform.; Value: 22nF; Supplier 1: Digi-Key; Supplier Part Number 1: 399-1242-1-ND
U1C6 = Cap2: Capacitor; Manufacturer: PANASONIC ELECTRONIC COMPONENTS; Manufacturer Part Number: ECA-1EM331B; Supplier 1: Newark; Supplier Part Number 1: 48W7648; Supplier 2: Mouser; Supplier Part Number 2: 667-ECA-1EM331B
U1D1 = D Schottky: DIODE SCHOTTKY 60V 5A SMC; Manufacturer Part Number: B560C-13-F; Manufacturer: Diodes Incorporated; Revision: July-2002: Re-released for DXP Platform.; Supplier 1: Digi-Key; Supplier Part Number 1: B560C-FDICT-ND
U1D2 = Diode: DIODE SCHOTTKY 40V 3A SMC; Manufacturer Part Number: B340-13-F; Manufacturer: Diodes Incorporated; Revision: July-2002: Re-released for DXP Platform.; Supplier 1: Digi-Key; Supplier Part Number 1: B340-FDICT-ND
U1L1 = IND: WE-PD SMD Shielded Power Inductor 100uH; Manufacturer Part Number: 74477020; Manufacturer: Wurth Elektronik; Supplier Part Number 1: 74477020; Supplier 1: Wurth Elektronik; Value: 100µH
U1R1 = Res1: RES 4.7K OHM 1/4W 5% 1206 SMD; Manufacturer Part Number: CRCW12064K70JNEA; Manufacturer: Vishay Dale; Revision: July-2002: Re-released for DXP Platform.; Value: 4.7KΩ; Supplier 1: Digi-Key; Supplier Part Number 1: 541-4.7KECT-ND
U1R2 = Res1: RES 2.70K OHM 1/8W 1% 0805 SMD; Manufacturer: Vishay Dale; Manufacturer Part Number: CRCW08052K70FKEA; Revision: July-2002: Re-released for DXP Platform.; Value: 2.7KΩ; Supplier 1: Digi-Key; Supplier Part Number 1: 541-2.70KCCT-ND
U1R3 = Res1: Manufacturer Part Number: ERA-6AEB3162V; Manufacturer: Panasonic Electronic Components; Revision: July-2002: Re-released for DXP Platform.; Value: 24KΩ; Supplier 1: Digi-Key; Supplier Part Number 1: P31.6KDACT-ND
U1TVS1 = Tranzorb: TVS 33 VOLT 600 WATT UNI-DIR TRANZORB; Manufacturer Part Number: P6KE33A; Manufacturer: Littelfuse Inc.; Supplier 1: Digi-Key; Supplier Part Number 1: P6KE33ALFCT-ND

## Sheet Modem-GPRS.SchDoc
size Letter; ApprovedBy: M. en C. Fernando Bolaños; CheckedBy: M. en C. José Alberto Balderas Castillo (CID); Author: M. en C. José Alberto Balderas Castillo (CID); Revision: v1; NombreTarjeta: TELCOMGPRS-v1; NumeroDeHoja: 5 de 7; NombreBloque: Puertos Seriales RS232 Externos; FechaDiseno: 02-Junio-2015; FechaRevision: 05-Junio-2015; FechaAprobacion: 16-Junio-2015; TamanoHoja: Carta; NombreProyecto: Telemetria GPRS de Bajo Consumo de Energia
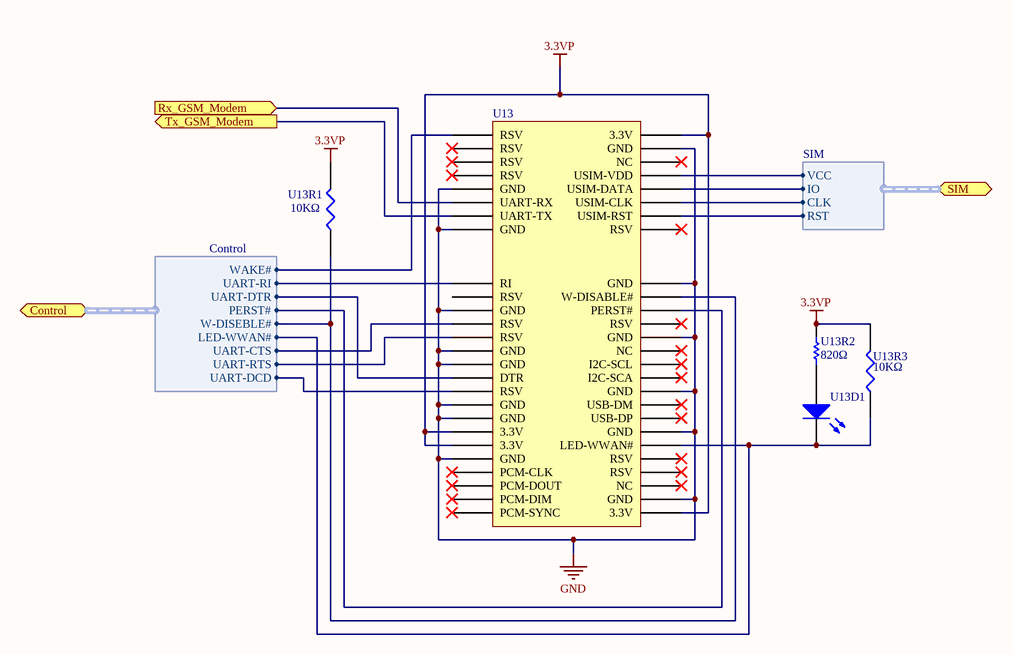
[diagram p7: Modem-GPRS.SchDoc]

### Parts
U13  MiniPCIe  [MiniPCI-52]  (value not drawn)
U13D1  LED2  [0805-LEDG]  (value not drawn)
U13R1  10KΩ  [0805-RES]
U13R2  820Ω  [0805-RES]
U13R3  10KΩ  [0805-RES]

### Ports
Control (harness Control), Rx_GSM_Modem (in), SIM (harness SIM), Tx_GSM_Modem (out)

### Harnesses
Control: UART-RI, UART-DTR, PERST#, W-DISEBLE#, LED-WWAN#, UART-CTS, UART-RTS, UART-DCD, WAKE#
SIM: VCC, IO, CLK, RST

### Nets
3.3VP: U13.2(3.3V) U13.39(3.3V) U13.41(3.3V) U13.52(3.3V) U13R1.2 U13R2.2 U13R3.2
GND: U13.4(GND) U13.9(GND) U13.15(GND) U13.18(GND) U13.21(GND) U13.26(GND) U13.27(GND) U13.29(GND) U13.34(GND) U13.35(GND) U13.37(GND) U13.40(GND) U13.43(GND) U13.50(GND)
UART-DCD: U13.33(RSV) ; port Control.UART-DCD
UART-RTS: U13.25(RSV) ; port Control.UART-RTS
WAKE#: U13.1(RSV) ; port Control.WAKE#
NetU6_5: U13.42(LED-WWAN#) U13D1.2(K) U13R3.1 ; port Control.LED-WWAN#
NetU6_13: U13.23(RSV) ; port Control.UART-CTS
NetU6_15: U13.20(W-DISABLE#) U13R1.1 ; port Control.W-DISEBLE#
NetU6_16: U13.31(DTR) ; port Control.UART-DTR
NetU6_17: U13.17(RI) ; port Control.UART-RI
NetU6_19: U13.22(PERST#) ; port Control.PERST#
NetU11_2: U13.11(UART-RX) ; port Rx_GSM_Modem
NetU11_4: U13.13(UART-TX) ; port Tx_GSM_Modem
NetU13_8: U13.8(USIM-VDD) ; port SIM.VCC
NetU13_10: U13.10(USIM-DATA) ; port SIM.IO
NetU13_12: U13.12(USIM-CLK) ; port SIM.CLK
NetU13_14: U13.14(USIM-RST) ; port SIM.RST
NetU13D1_1: U13D1.1(A) U13R2.1

Not connected (* = marked no-connect by the designer): U13 3(RSV)* 5(RSV)* 6(NC)* 7(RSV)* 16(RSV)* 19(RSV) 24(RSV)* 28(NC)* 30(I2C-SCL)* 32(I2C-SCA)* 36(USB-DM)* 38(USB-DP)* 44(RSV)* 45(PCM-CLK)* 46(RSV)* 47(PCM-DOUT)* 48(NC)* 49(PCM-DIM)* 51(PCM-SYNC)*

### Notes on the sheet
- Elaboró
- Fecha
- Nombre del artículo
- Revisó
- Aprobó
- Número de parte
- Revisión
- Escala
- N/A
- Sección afectada
- Descripción del cambio
- Lámina
- 1/1
- Tolerancias
- Ruta del archivo

### Library data of the parts
U13 = PCIM: Mini PCIe; Manufacturer: TE Connectivity AMP Connectors; Manufacturer Part Number: 2041119-1; Supplier 1: Digi-Key; Supplier Part Number 1: A108265CT-ND
U13D1 = LED2: as U6LED2 on sheet MSP430; Supplier 2: Digi-Key; Supplier Part Number 2: 732-4983-1-ND; Supplier 3: Newark; Supplier Part Number 3: 95W3800; Supplier 1: Wurth Elektronik; Supplier Part Number 1: 150080GS75000
U13R1 U13R3 = RES1: as U7R1 on sheet Interfaz de Memoria; Value: 10KΩ; Supplier 1: Digi-Key; Supplier Part Number 1: 311-10KARCT-ND
U13R2 = Res1: as U6R7 on sheet MSP430; Value: 820Ω; Supplier 2: Newark; Supplier Part Number 2: 65T8844; Manufacturer: PANASONIC ELECTRONIC COMPONENTS; Manufacturer Part Number: ERJ-6GEYJ821V; Supplier 1: Digi-Key; Supplier Part Number 1: P820ACT-ND

## Sheet SIM.SchDoc
size Letter; Address1: L3, 12a Rodborough Rd; Address2: Frenchs Forest; Address3: NSW; Address4: Australia 2086
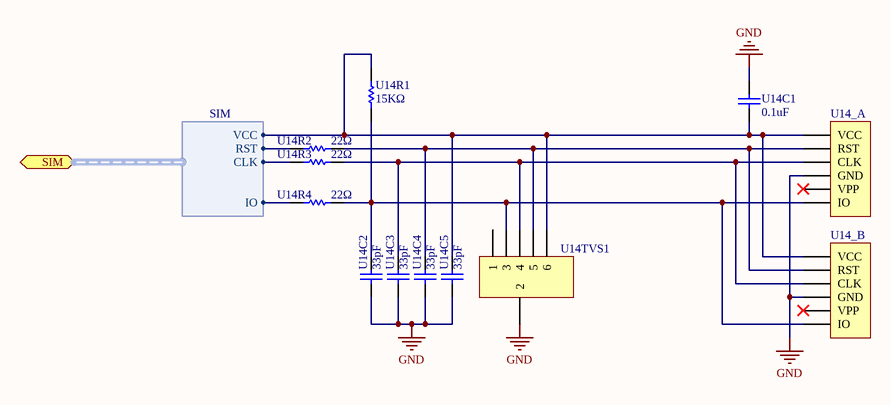
[diagram p8: SIM.SchDoc]

### Parts
U14_A  0786463001  [0786463001-SIM]  (value not drawn)
U14_B  7111S2015X02LF  [SIM-6]  (value not drawn)
U14C1  0.1uF  [0603 - CAP]
U14C2  33pF  [0805-cap]
U14C3  33pF  [0805-cap]
U14C4  33pF  [0805-cap]
U14C5  33pF  [0805-cap]
U14R1  15KΩ  [0805-RES]
U14R2  22Ω  [0805-RES]
U14R3  22Ω  [0805-RES]
U14R4  22Ω  [0805-RES]
U14TVS1  SMF05C.TCT  [SC70-6]  (value not drawn)

### Ports
SIM (harness SIM)

### Harnesses
SIM: VCC, IO, CLK, RST

### Nets
GND: U14_A.5(GND) U14_B.5(GND) U14C1.2 U14C2.1 U14C3.1 U14C4.1 U14C5.1 U14TVS1.2
NetU13_8: U14_A.1(VCC) U14_B.1(VCC) U14C1.1 U14C5.2 U14R1.1 U14TVS1.6 ; port SIM.VCC
NetU13_10: U14R4.1 ; port SIM.IO
NetU13_12: U14R3.1 ; port SIM.CLK
NetU13_14: U14R2.1 ; port SIM.RST
NetU14_A_2: U14_A.2(RST) U14_B.2(RST) U14C4.2 U14R2.2 U14TVS1.5
NetU14_A_3: U14_A.3(CLK) U14_B.3(CLK) U14C3.2 U14R3.2 U14TVS1.4
NetU14_A_7: U14_A.7(IO) U14_B.7(IO) U14C2.2 U14R1.2 U14R4.2 U14TVS1.3

Not connected (* = marked no-connect by the designer): U14_A 6(VPP)*; U14_B 6(VPP)*; U14TVS1 1

### Notes on the sheet
- Elaboró
- Fecha
- Nombre del artículo
- Revisó
- Aprobó
- Número de parte
- Revisión
- Escala
- N/A
- Sección afectada
- Descripción del cambio
- Lámina
- 1/1
- Tolerancias
- Ruta del archivo

### Library data of the parts
U14_A = Header 6: '6 Position Card Connector Micro SIM Surface Mount, Right Angle Gold; Manufacturer: Molex, LLC; Supplier 1: Digi-Key; Supplier Part Number 1: WM9364CT-ND; Manufacturer Part Number: 0786463001; Supplier 2: Mouser; Supplier Part Number 2: 538-78646-3001
U14_B = Header 6: 6 Position Card Connector SIM Card Surface Mount, Right Angle Gold; Manufacturer: Amphenol FCI; Supplier 1: Digi-Key; Supplier Part Number 1: 609-1401-1-ND; Manufacturer Part Number: 7111S2015X02LF
U14C1 = Cap: as U7C1 on sheet Interfaz de Memoria; Value: 0.1uF; Supplier 1: Digi-Key; Supplier Part Number 1: 445-8129-1-ND
U14C2-U14C5 = Cap: 33pF 50V Ceramic Capacitor C0G, NP0 0805 (2012 Metric) 0.079" L x 0.049" W (2.00mm x 1.25mm); Manufacturer: Kemet; Manufacturer Part Number: C0805C330J5GACTU; Value: 33pF; Supplier 1: Digi-Key; Supplier Part Number 1: 399-1115-1-ND
U14R1 = Res1: RES SMD 15K OHM 1% 1/8W 0805; Manufacturer: Panasonic Electronic Components; Manufacturer Part Number: ERJ-6ENF1502V; Value: 15KΩ; Supplier 1: Digi-Key; Supplier Part Number 1: P15.0KCCT-ND
U14R2-U14R4 = Res1: RES SMD 22 OHM 1% 1/8W 0805; Manufacturer: Panasonic Electronic Components; Manufacturer Part Number: ERJ-6ENF22R0V; Value: 22Ω; Supplier 1: Digi-Key; Supplier Part Number 1: P22.0CCT-ND
U14TVS1 = Header 6: TVS DIODE 5V 12.5V SC70-6; Manufacturer: Semtech Corporation; Supplier 1: Digi-Key; Supplier Part Number 1: SMF05CCT-ND; Manufacturer Part Number: SMF05C.TCT

## Sheet Interfaz_RS232.SchDoc
size Letter; ApprovedBy: M. en C. Fernando Bolaños; CheckedBy: M. en C. José Alberto Balderas Castillo (CID); Author: M. en C. José Alberto Balderas Castillo (CID); Revision: v1; NombreTarjeta: TELCOMGPRS-v1; NumeroDeHoja: 5 de 7; NombreBloque: Puertos Seriales RS232 Externos; FechaDiseno: 02-Junio-2015; FechaRevision: 05-Junio-2015; FechaAprobacion: 16-Junio-2015; TamanoHoja: Carta; NombreProyecto: Telemetria GPRS de Bajo Consumo de Energia
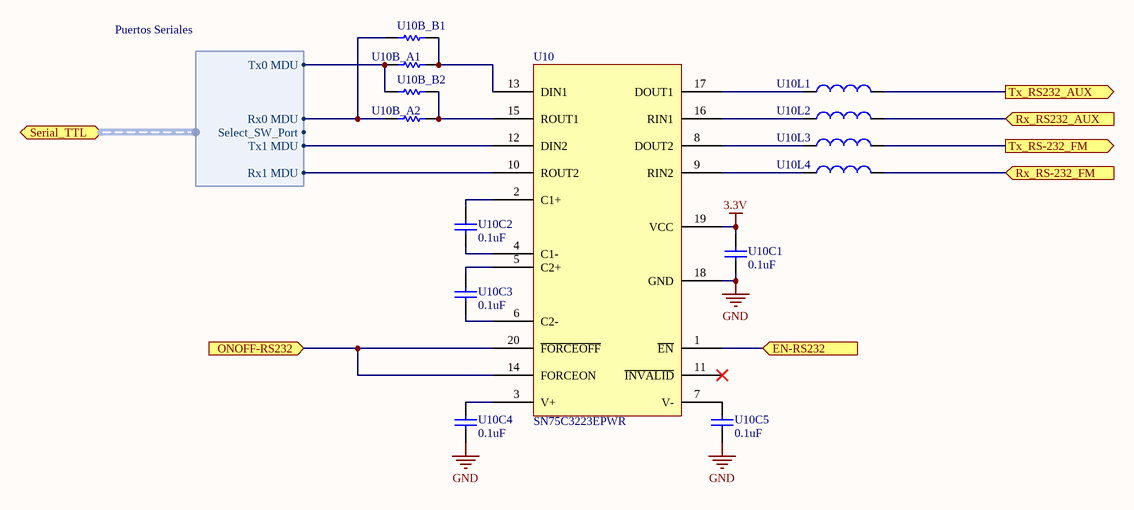
[diagram p9: Interfaz_RS232.SchDoc]

### Parts
U10  SN75C3223EPWR  [TSSOP-20]
U10B_A1  (no value)  [Bypass Bridge]
U10B_A2  (no value)  [Bypass Bridge]
U10B_B1  (no value)  [Bypass Bridge]
U10B_B2  (no value)  [Bypass Bridge]
U10C1  0.1uF  [0603 - CAP]
U10C2  0.1uF  [0603 - CAP]
U10C3  0.1uF  [0603 - CAP]
U10C4  0.1uF  [0603 - CAP]
U10C5  0.1uF  [0603 - CAP]
U10L1  74279214  [1206-IND]  (value not drawn)
U10L2  74279214  [1206-IND]  (value not drawn)
U10L3  74279214  [1206-IND]  (value not drawn)
U10L4  74279214  [1206-IND]  (value not drawn)

### Ports
EN-RS232 (in), ONOFF-RS232 (in), Rx_RS232_AUX (in), Rx_RS-232_FM (in), Serial_TTL (harness Puertos Seriales), Tx_RS232_AUX (out), Tx_RS-232_FM (out)

### Harnesses
Puertos Seriales: Select_SW_Port, Tx0 MDU, Rx1 MDU, Rx0 MDU, Tx1 MDU

### Nets
3.3V: U10.19(VCC) U10C1.2
GND: U10.18(GND) U10C1.1 U10C4.1 U10C5.1
Rx1_RS232: U10L4.2 ; port Rx_RS-232_FM
Rx2_RS232: U10L2.2 ; port Rx_RS232_AUX
Tx1_RS232: U10L3.2 ; port Tx_RS-232_FM
Tx2_RS232: U10L1.2 ; port Tx_RS232_AUX
NetU6_3: U10.1(~{EN}) ; port EN-RS232
NetU6_4: U10.14(FORCEON) U10.20(~{FORCEOFF}) ; port ONOFF-RS232
NetU6_32: U10B_A1.1 U10B_B2.2 ; port Serial_TTL.Tx0 MDU
NetU6_33: U10B_A2.1 U10B_B1.2 ; port Serial_TTL.Rx0 MDU
NetU6_34: U10.12(DIN2) ; port Serial_TTL.Tx1 MDU
NetU6_35: U10.10(ROUT2) ; port Serial_TTL.Rx1 MDU
NetU10_2: U10.2(C1+) U10C2.2
NetU10_3: U10.3(V+) U10C4.2
NetU10_4: U10.4(C1-) U10C2.1
NetU10_5: U10.5(C2+) U10C3.2
NetU10_6: U10.6(C2-) U10C3.1
NetU10_7: U10.7(V-) U10C5.2
NetU10_8: U10.8(DOUT2) U10L3.1
NetU10_9: U10.9(RIN2) U10L4.1
NetU10_13: U10.13(DIN1) U10B_A1.2 U10B_B1.1
NetU10_15: U10.15(ROUT1) U10B_A2.2 U10B_B2.1
NetU10_16: U10.16(RIN1) U10L2.1
NetU10_17: U10.17(DOUT1) U10L1.1

Not connected (* = marked no-connect by the designer): U10 11(~{INVALID})*

### Notes on the sheet
- Elaboró
- Fecha
- Nombre del artículo
- Revisó
- Aprobó
- Número de parte
- Revisión
- Escala
- N/A
- Sección afectada
- Descripción del cambio
- Lámina
- 1/1
- Tolerancias
- Ruta del archivo

### Library data of the parts
U10 = SN75C3223EPWR: IC LINE DRVR/RCVR RS232 20-TSSOP; Manufacturer: Texas Instruments; Manufacturer Part Number: SN75C3223EPWR; Supplier 1: Digi-Key; Supplier Part Number 1: 296-21078-1-ND
U10B_A1 U10B_A2 U10B_B1 U10B_B2 = Res1: No Aplica; Numero de Parte: No Aplica
U10C1-U10C5 = Cap: as U7C1 on sheet Interfaz de Memoria; Value: 0.1uF; Supplier 1: Digi-Key; Supplier Part Number 1: 445-8129-1-ND
U10L1-U10L4 = Inductor: FERRITE BEAD 1000 OHM .20A 1206; Manufacturer: Wurth Elektronik; Value: 450 mΩ; Manufacturer Part Number: 74279214; Supplier Part Number 1: 74279214; Supplier 1: Wurth Elektronik; Supplier 2: Digi-Key; Supplier Part Number 2: 732-1627-1-ND

## Sheet UART_Multiplexor.SchDoc
size Letter
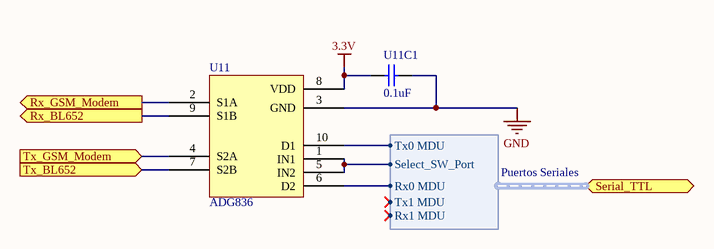
[diagram p10: UART_Multiplexor.SchDoc]

### Parts
U11  ADG836  [ADG836]
U11C1  0.1uF  [0603 - CAP]

### Ports
Rx_BL652 (out), Rx_GSM_Modem (out), Serial_TTL (harness Puertos Seriales), Tx_BL652 (in), Tx_GSM_Modem (in)

### Harnesses
Puertos Seriales: Select_SW_Port, Tx0 MDU, Rx1 MDU, Rx0 MDU, Tx1 MDU

### Nets
3.3V: U11.8(VDD) U11C1.2
GND: U11.3(GND) U11C1.1
BT_Rx: U11.9(S1B) ; port Rx_BL652
BT_Tx: U11.7(S2B) ; port Tx_BL652
NetU6_30: U11.1(IN1) U11.5(IN2) ; port Serial_TTL.Select_SW_Port
NetU6_32: U11.10(D1) ; port Serial_TTL.Tx0 MDU
NetU6_33: U11.6(D2) ; port Serial_TTL.Rx0 MDU
NetU11_2: U11.2(S1A) ; port Rx_GSM_Modem
NetU11_4: U11.4(S2A) ; port Tx_GSM_Modem

### Notes on the sheet
- Elaboró
- Fecha
- Nombre del artículo
- Revisó
- Aprobó
- Número de parte
- Revisión
- Escala
- N/A
- Sección afectada
- Descripción del cambio
- Lámina
- 1/1
- Tolerancias
- Ruta del archivo

### Library data of the parts
U11 = ADG836: IC SWITCH DUAL SPDT 10MSOP; Manufacturer: Analog Devices Inc.; Manufacturer Part Number: ADG836YRMZ; Supplier 1: Digi-Key; Supplier Part Number 1: ADG836YRMZ-ND
U11C1 = Cap: as U7C1 on sheet Interfaz de Memoria; Value: 0.1uF; Supplier 1: Digi-Key; Supplier Part Number 1: 445-8129-1-ND

## Sheet SDCard.SchDoc
size Letter
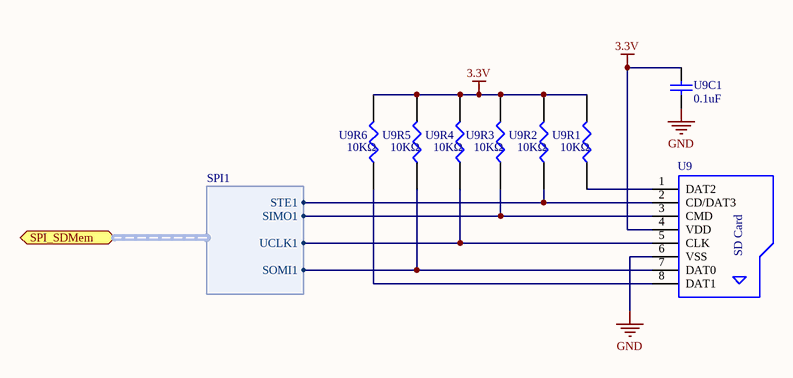
[diagram p11: SDCard.SchDoc]

### Parts
U9  WE-Card Connectors 693072010801  [693072010801]  (value not drawn)
U9C1  0.1uF  [0603 - CAP]
U9R1  10KΩ  [0805-RES]
U9R2  10KΩ  [0805-RES]
U9R3  10KΩ  [0805-RES]
U9R4  10KΩ  [0805-RES]
U9R5  10KΩ  [0805-RES]
U9R6  10KΩ  [0805-RES]

### Ports
SPI_SDMem (harness SPI1)

### Harnesses
SPI1: STE1, SIMO1, SOMI1, UCLK1

### Nets
3.3V: U9.4(VDD) U9C1.1 U9R1.2 U9R2.2 U9R3.2 U9R4.2 U9R5.2 U9R6.2
GND: U9.6(VSS) U9C1.2
NetU6_44: U9.2(CD/DAT3) U9R2.1 ; port SPI_SDMem.STE1
NetU6_45: U9.3(CMD) U9R3.1 ; port SPI_SDMem.SIMO1
NetU6_46: U9.7(DAT0) U9R5.1 ; port SPI_SDMem.SOMI1
NetU6_47: U9.5(CLK) U9R4.1 ; port SPI_SDMem.UCLK1
NetU9_1: U9.1(DAT2) U9R1.1
NetU9_8: U9.8(DAT1) U9R6.1

### Notes on the sheet
- Elaboró
- Fecha
- Nombre del artículo
- Revisó
- Aprobó
- Número de parte
- Revisión
- Escala
- N/A
- Sección afectada
- Descripción del cambio
- Lámina
- 1/1
- Tolerancias
- Ruta del archivo
- (in symbol WE-Card Connectors 693072010801) SD Card

### Library data of the parts
U9 = WE-Card Connectors 693072010801: WR-CRD Micro SD_Hinge / CONN MICRO SD CARD HINGED TYPE; Manufacturer: Würth Elektronik; Manufacturer Part Number: 693072010801; Supplier Part Number 1: 693072010801; Supplier 1: Wuth Elekronik; Supplier 2: Digi-Key; Supplier Part Number 2: 732-3820-1-ND
U9C1 = Cap: as U7C1 on sheet Interfaz de Memoria; Value: 0.1uF; Supplier 1: Digi-Key; Supplier Part Number 1: 445-8129-1-ND
U9R1-U9R6 = RES1: as U7R1 on sheet Interfaz de Memoria; Value: 10KΩ; Supplier 1: Digi-Key; Supplier Part Number 1: 311-10KARCT-ND

## Sheet Modulo BL652.SchDoc
size Letter
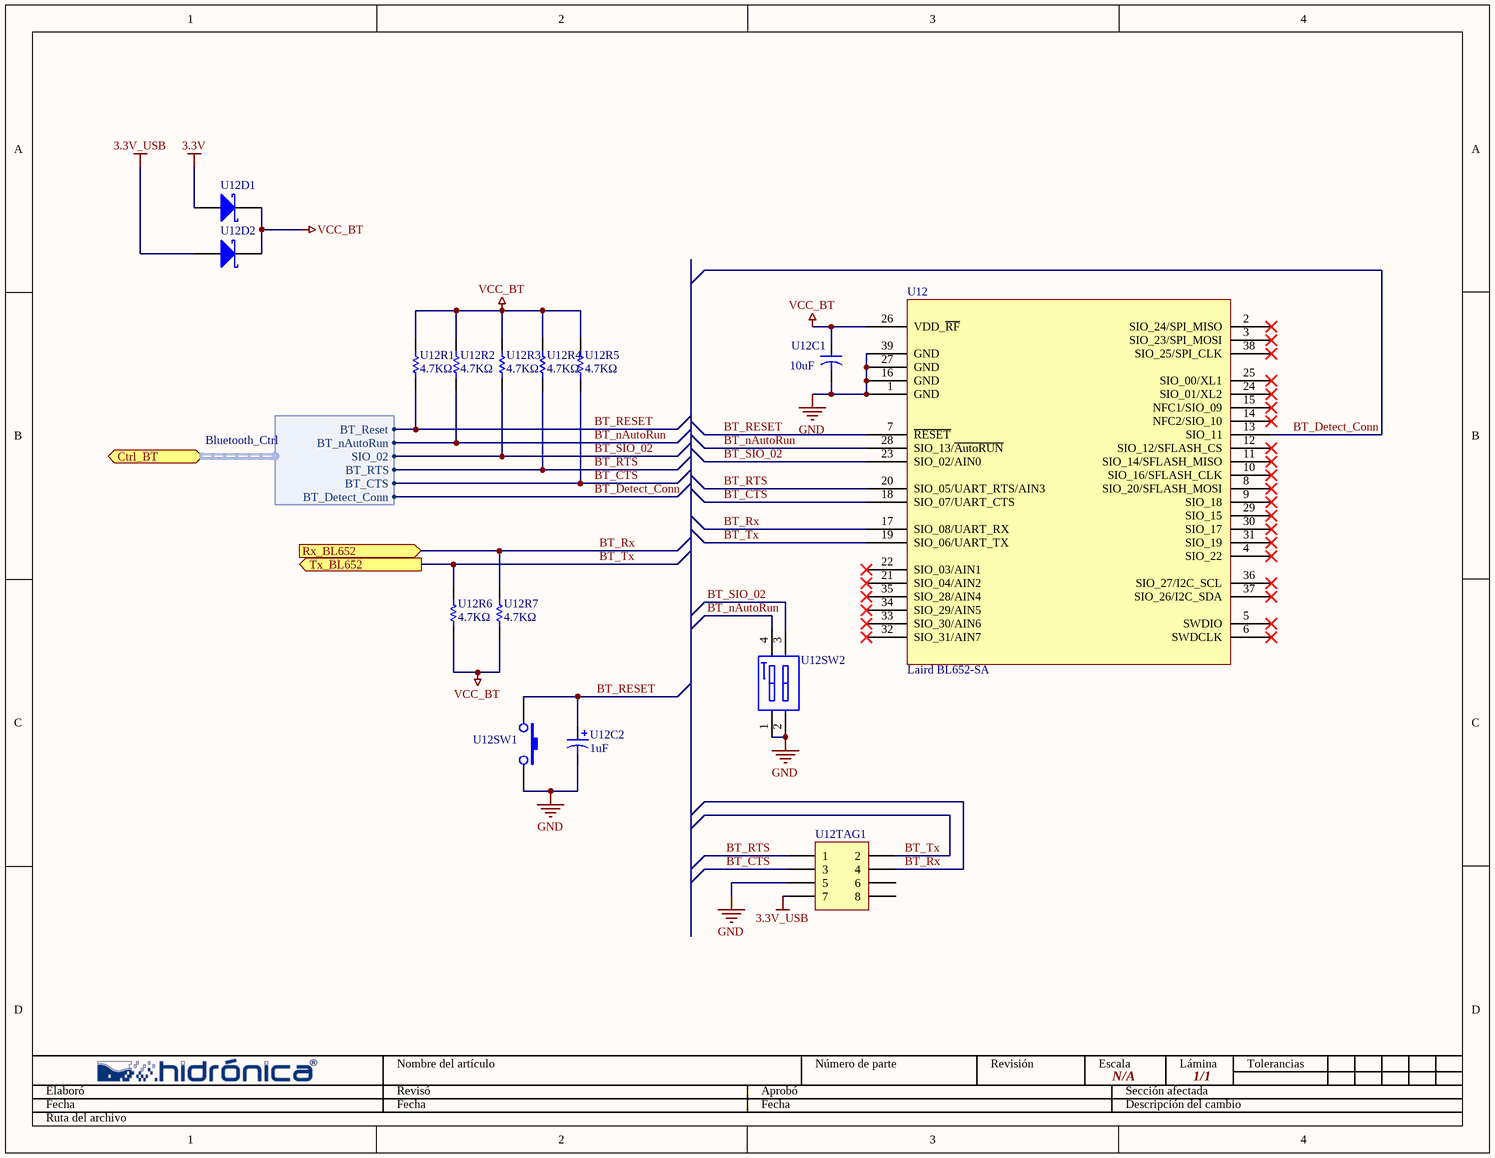
[diagram p12: Modulo BL652.SchDoc]

### Parts
U12  Laird BL652-SA  [BT652]
U12C1  10uF  [1206-CAP]
U12C2  1uF  [0805-tan]
U12D1  NSR0320MW2T1G  [SOD-323]  (value not drawn)
U12D2  NSR0320MW2T1G  [SOD-323]  (value not drawn)
U12R1  4.7KΩ  [0805-RES]
U12R2  4.7KΩ  [0805-RES]
U12R3  4.7KΩ  [0805-RES]
U12R4  4.7KΩ  [0805-RES]
U12R5  4.7KΩ  [0805-RES]
U12R6  4.7KΩ  [0805-RES]
U12R7  4.7KΩ  [0805-RES]
U12SW1  (no value)  [430 473 031 826]
U12SW2  SW DIP-2  [CHS-02TA]  (value not drawn)
U12TAG1  Header 4X2  [690367290876]  (value not drawn)

### Ports
Ctrl_BT (harness Bluetooth_Ctrl), Rx_BL652 (in), Tx_BL652 (out)

### Harnesses
Bluetooth_Ctrl: BT_Reset, BT_nAutoRun, SIO_02, BT_RTS, BT_CTS, BT_Detect_Conn

### Nets
3.3V: U12D1.1(A)
3.3V_USB: U12D2.1(A) U12TAG1.7
GND: U12.1(GND) U12.16(GND) U12.27(GND) U12.39(GND) U12C1.2 U12C2.2 U12SW1.2 U12SW2.1(A1) U12SW2.2(A2) U12TAG1.5
VCC_BT: U12.26(VDD_~{RF}) U12C1.1 U12D1.2(K) U12D2.2(K) U12R1.1 U12R2.1 U12R3.1 U12R4.1 U12R5.1 U12R6.2 U12R7.2
BT_CTS: U12.18(SIO_07/UART_CTS) U12R5.2 U12TAG1.3 ; port Ctrl_BT.BT_CTS
BT_Detect_Conn: U12.13(SIO_11) ; port Ctrl_BT.BT_Detect_Conn
BT_nAutoRun: U12.28(SIO_13/~{AutoRUN}) U12R2.2 U12SW2.4(B1) ; port Ctrl_BT.BT_nAutoRun
BT_RESET: U12.7(~{RESET}) U12C2.1 U12R1.2 U12SW1.1 ; port Ctrl_BT.BT_Reset
BT_RTS: U12.20(SIO_05/UART_RTS/AIN3) U12R4.2 U12TAG1.1 ; port Ctrl_BT.BT_RTS
BT_Rx: U12.17(SIO_08/UART_RX) U12R7.1 U12TAG1.4 ; port Rx_BL652
BT_SIO_02: U12.23(SIO_02/AIN0) U12R3.2 U12SW2.3(B2) ; port Ctrl_BT.SIO_02
BT_Tx: U12.19(SIO_06/UART_TX) U12R6.1 U12TAG1.2 ; port Tx_BL652

Not connected (* = marked no-connect by the designer): U12 2(SIO_24/SPI_MISO)* 3(SIO_23/SPI_MOSI)* 4(SIO_22)* 5(SWDIO)* 6(SWDCLK)* 8(SIO_20/SFLASH_MOSI)* 9(SIO_18)* 10(SIO_16/SFLASH_CLK)* 11(SIO_14/SFLASH_MISO)* 12(SIO_12/SFLASH_CS)* 14(NFC2/SIO_10)* 15(NFC1/SIO_09)* 21(SIO_04/AIN2)* 22(SIO_03/AIN1)* 24(SIO_01/XL2)* 25(SIO_00/XL1)* 29(SIO_15)* 30(SIO_17)* 31(SIO_19)* 32(SIO_31/AIN7)* 33(SIO_30/AIN6)* 34(SIO_29/AIN5)* 35(SIO_28/AIN4)* 36(SIO_27/I2C_SCL)* 37(SIO_26/I2C_SDA)* 38(SIO_25/SPI_CLK)*; U12TAG1 6 8

### Notes on the sheet
- Elaboró
- Fecha
- Nombre del artículo
- Revisó
- Aprobó
- Número de parte
- Revisión
- Escala
- N/A
- Sección afectada
- Descripción del cambio
- Lámina
- 1/1
- Tolerancias
- Ruta del archivo

### Library data of the parts
U12 = BL652_SA: Manufacturer Part Number: BL652-SA-01-T/R; Manufacturer: Laird; Supplier Part Number 1: BL652-SA-01-CT-ND; Supplier 1: Digi-Key; Supplier 2: Mouser; Supplier Part Number 2: 239-BL652-SA-01; Supplier 3: Newark; Supplier Part Number 3: 01AC1558
U12C1 = Cap2: CAP TANTALUM 10UF 6.3V 10% SMD; Manufacturer: Kemet; Manufacturer Part Number: T491A106K010AT; Value: 10uF; Supplier 1: Digi-Key; Supplier Part Number 1: 399-3684-1-ND
U12C2 = Cap Pol1: as U6C1 on sheet MSP430; Value: 1uF; Supplier 1: Digi-Key; Supplier Part Number 1: 478-3278-1-ND
U12D1 U12D2 = 10MQ060N: DIODE SCHOTTKY 1A 20V SOD-323; Manufacturer: ON Semiconductor; Manufacturer Part Number: NSR0320MW2T1G; Supplier 1: Digi-Key; Supplier Part Number 1: NSR0320MW2T1GOSCT-ND
U12R1-U12R7 = Res1: RES SMD 4.7K OHM 5% 1/8W 0805; Manufacturer: Panasonic Electronic Components; Manufacturer Part Number: ERJ-6GEYJ472V; Value: 4.7KΩ; Supplier 1: Digi-Key; Supplier Part Number 1: P4.7KACT-ND
U12SW1 = SW-PB: SWITCH TACTILE SPST-NO 0.02A 15V SMT; Manufacturer Part Number: EVQ-Q2K03W; Manufacturer: Panasonic Electronic Components; Supplier Part Number 1: P12943SCT-ND; Supplier 1: Digi-Key
U12SW2 = SW DIP-2: SWITCH SLIDE DIP SPST 100MA 6V; Manufacturer: Nidec Copal Electronics; Manufacturer Part Number: CHS-02TA; Supplier Part Number 1: 563-1005-1-ND; Supplier 1: Digi-Key
U12TAG1 = Header 4X2: Female SMT Straight Connector with Latch and with Polarization WR-MM 8-Pin; Contraparte: 690 157 000 872; Manufacturer Part Number: 690 367 290 876; Manuacturer: Wurth Elektronik; Supplier Part Number 1: 690 367 290 876; Supplier 1: Wurth Elektronik